# Altium schematic sheet VD Sensors.SchDoc
size A4
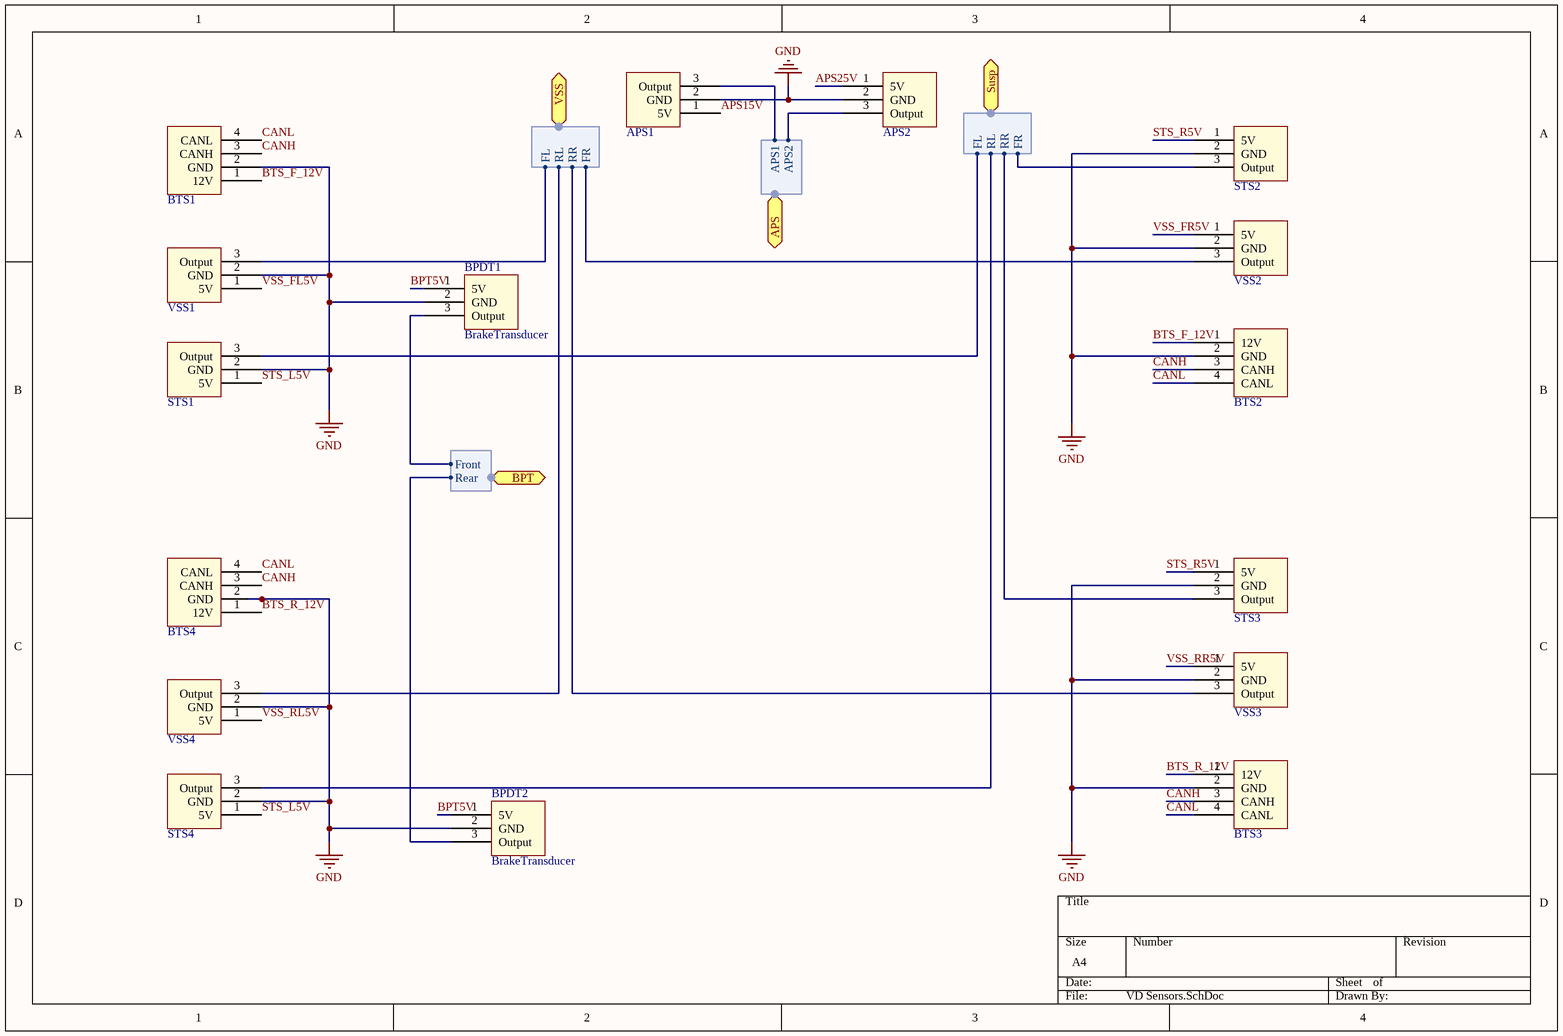
[diagram p0: VD Sensors.SchDoc]

## Parts
APS1  APS  (value not drawn)
APS2  APS  (value not drawn)
BPDT1  BrakeTransducer
BPDT2  BrakeTransducer
BTS1  BTS  (value not drawn)
BTS2  BTS  (value not drawn)
BTS3  BTS  (value not drawn)
BTS4  BTS  (value not drawn)
STS1  Susp  (value not drawn)
STS2  Susp  (value not drawn)
STS3  Susp  (value not drawn)
STS4  Susp  (value not drawn)
VSS1  VSS  (value not drawn)
VSS2  VSS  (value not drawn)
VSS3  VSS  (value not drawn)
VSS4  VSS  (value not drawn)

## Ports
APS (harness APS), BPT (harness BPT), Susp (harness Susp), VSS (harness VSS)

## Harnesses
VSS: FL, FR, RL, RR
Susp: FL, FR, RL, RR
APS: APS2, APS1
BPT: Rear, Front

## Nets
GND: APS1.2(GND) APS2.2(GND) BPDT1.2(GND) BPDT2.2(GND) BTS1.2(GND) BTS2.2(GND) BTS3.2(GND) BTS4.2(GND) STS1.2(GND) STS2.2(GND) STS3.2(GND) STS4.2(GND) VSS1.2(GND) VSS2.2(GND) VSS3.2(GND) VSS4.2(GND)
APS15V: APS1.1(5V)
APS25V: APS2.1(5V)
BPT5V: BPDT1.1(5V) BPDT2.1(5V)
BTS_F_12V: BTS1.1(12V) BTS2.1(12V)
BTS_R_12V: BTS3.1(12V) BTS4.1(12V)
CANH: BTS1.3(CANH) BTS2.3(CANH) BTS3.3(CANH) BTS4.3(CANH)
CANL: BTS1.4(CANL) BTS2.4(CANL) BTS3.4(CANL) BTS4.4(CANL)
STS_L5V: STS1.1(5V) STS4.1(5V)
STS_R5V: STS2.1(5V) STS3.1(5V)
VSS_FL5V: VSS1.1(5V)
VSS_FR5V: VSS2.1(5V)
VSS_RL5V: VSS4.1(5V)
VSS_RR5V: VSS3.1(5V)
NetAPS1_3: APS1.3(Output) ; port APS.APS1
NetAPS2_3: APS2.3(Output) ; port APS.APS2
NetBPDT1_3: BPDT1.3(Output) ; port BPT.Front
NetBPDT2_3: BPDT2.3(Output) ; port BPT.Rear
NetSTS1_3: STS1.3(Output) ; port Susp.FL
NetSTS2_3: STS2.3(Output) ; port Susp.FR
NetSTS3_3: STS3.3(Output) ; port Susp.RR
NetSTS4_3: STS4.3(Output) ; port Susp.RL
NetVSS1_3: VSS1.3(Output) ; port VSS.FL
NetVSS2_3: VSS2.3(Output) ; port VSS.FR
NetVSS3_3: VSS3.3(Output) ; port VSS.RR
NetVSS4_3: VSS4.3(Output) ; port VSS.RL

## Library data of the parts
APS1 APS2 = APS: Accelerator Pedal Sensor
BPDT1 BPDT2 = BrakeTransducer: Brake Pressure Transducer
BTS1-BTS4 = BTS: Brake Temperature Sensor
STS1-STS4 = VSS: Suspension Travel Sensor
VSS1-VSS4 = VSS: Vehicle Speed Sensor